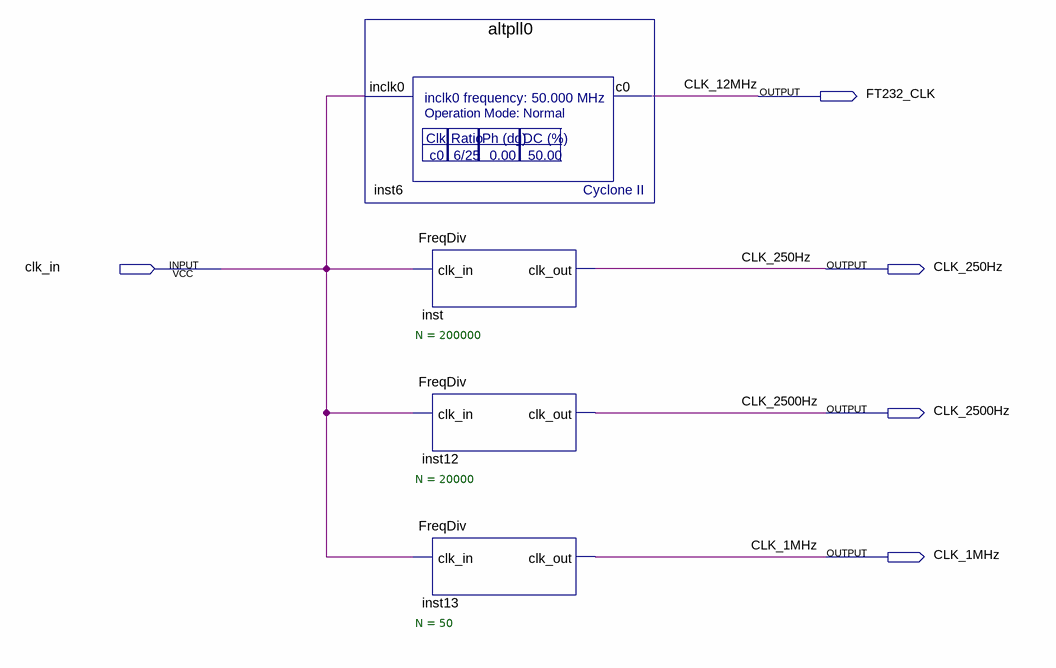
[diagram p0: schematic sheet]
// Quartus schematic Clock.bdf as structural Verilog: 4 symbols, 5 pins
module Clock (
  input  clk_in,
  output FT232_CLK,
  output CLK_250Hz,
  output CLK_2500Hz,
  output CLK_1MHz
);

  altpll0 inst6 (.inclk0(clk_in), .c0(FT232_CLK));
  FreqDiv #(.N(200000)) inst (.clk_in(clk_in), .clk_out(CLK_250Hz));
  FreqDiv #(.N(20000)) inst12 (.clk_in(clk_in), .clk_out(CLK_2500Hz));
  FreqDiv #(.N(50)) inst13 (.clk_in(clk_in), .clk_out(CLK_1MHz));

  // Other names for the same wires on the sheet: CLK_12MHz = FT232_CLK
endmodule
